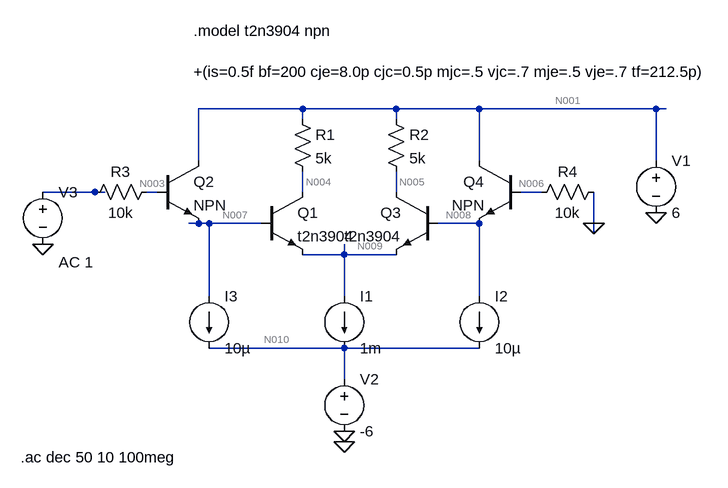
[diagram p0: schematic prob-3.asc]
prob-3.asc, the LTspice schematic file:
Version 4
SHEET 1 932 680
WIRE 176 0 16 0
WIRE 320 0 176 0
WIRE 448 0 320 0
WIRE 720 0 448 0
WIRE 736 0 720 0
WIRE 176 16 176 0
WIRE 320 16 320 0
WIRE 16 80 16 0
WIRE 448 80 448 0
WIRE 720 80 720 0
WIRE -144 128 -224 128
WIRE -128 128 -144 128
WIRE -48 128 -64 128
WIRE 176 128 176 96
WIRE 320 128 320 96
WIRE 544 128 512 128
WIRE 16 176 0 176
WIRE 32 176 16 176
WIRE 112 176 32 176
WIRE 448 176 384 176
WIRE 624 176 624 128
WIRE 624 192 624 176
WIRE 240 224 240 208
WIRE 240 224 176 224
WIRE 320 224 240 224
WIRE 32 288 32 176
WIRE 240 288 240 224
WIRE 448 288 448 176
WIRE 240 368 32 368
WIRE 448 368 240 368
WIRE 240 416 240 368
FLAG 240 512 0
FLAG 240 496 0
FLAG 720 160 0
FLAG 624 176 0
FLAG -224 208 0
SYMBOL npn 112 128 R0
SYMATTR InstName Q1
SYMATTR Value t2n3904
SYMBOL npn -48 80 R0
SYMATTR InstName Q2
SYMBOL npn 384 128 M0
SYMATTR InstName Q3
SYMATTR Value t2n3904
SYMBOL npn 512 80 M0
SYMATTR InstName Q4
SYMBOL current 240 288 R0
WINDOW 123 0 0 Left 2
WINDOW 39 0 0 Left 2
SYMATTR InstName I1
SYMATTR Value 1m
SYMBOL current 448 288 R0
WINDOW 123 0 0 Left 2
WINDOW 39 0 0 Left 2
SYMATTR InstName I2
SYMATTR Value 10µ
SYMBOL current 32 288 R0
WINDOW 123 0 0 Left 2
WINDOW 39 0 0 Left 2
SYMATTR InstName I3
SYMATTR Value 10µ
SYMBOL voltage 720 64 R0
WINDOW 123 0 0 Left 2
WINDOW 39 0 0 Left 2
SYMATTR InstName V1
SYMATTR Value 6
SYMBOL voltage 240 400 R0
WINDOW 123 0 0 Left 2
WINDOW 39 0 0 Left 2
SYMATTR InstName V2
SYMATTR Value -6
SYMBOL res 160 0 R0
SYMATTR InstName R1
SYMATTR Value 5k
SYMBOL res 304 0 R0
SYMATTR InstName R2
SYMATTR Value 5k
SYMBOL voltage -224 112 R0
WINDOW 123 24 124 Left 2
WINDOW 39 0 0 Left 2
SYMATTR InstName V3
SYMATTR Value ""
SYMATTR Value2 AC 1
SYMBOL res -48 112 R90
WINDOW 0 0 56 VBottom 2
WINDOW 3 32 56 VTop 2
SYMATTR InstName R3
SYMATTR Value 10k
SYMBOL res 640 112 R90
WINDOW 0 0 56 VBottom 2
WINDOW 3 32 56 VTop 2
SYMATTR InstName R4
SYMATTR Value 10k
TEXT 8 -120 Left 2 !.model t2n3904 npn\n\n+(is=0.5f bf=200 cje=8.0p cjc=0.5p mjc=.5 vjc=.7 mje=.5 vje=.7 tf=212.5p)
TEXT -258 536 Left 2 !.ac dec 50 10 100meg

The netlist it stands for:
* prob-3.asc
Q1 N004 N007 N009 0 t2n3904
Q2 N001 N003 N007 0 NPN
Q3 N005 N008 N009 0 t2n3904
Q4 N001 N006 N008 0 NPN
I1 N009 N010 1m
I2 N008 N010 10µ
I3 N007 N010 10µ
V1 N001 0 6
V2 N010 0 -6
R1 N001 N004 5k
R2 N001 N005 5k
V3 N002 0 AC 1
R3 N003 N002 10k
R4 0 N006 10k
.model NPN NPN
.model PNP PNP
.lib standard.bjt
.model t2n3904 npn
+(is=0.5f bf=200 cje=8.0p cjc=0.5p mjc=.5 vjc=.7 mje=.5 vje=.7 tf=212.5p)
.ac dec 50 10 100meg
.backanno
.end

* Results of the author's LTspice run, read from the files saved beside the schematic
* Operating Point, zero values left out:
*   V(n004) = 3.512 V
*   V(n007) = -661.8 mV
*   V(n009) = -1.376 V
*   V(n001) = 6 V
*   V(n003) = -1.236 mV
*   V(n005) = 3.512 V
*   V(n008) = -661.8 mV
*   V(n006) = -1.236 mV
*   V(n010) = -6 V
*   Ic(Q4) = 12.36 µA
*   Ib(Q4) = 123.6 nA
*   Ie(Q4) = -12.49 µA
*   Ic(Q2) = 12.36 µA
*   Ib(Q2) = 123.6 nA
*   Ie(Q2) = -12.49 µA
*   Ic(Q3) = 497.5 µA
*   Ib(Q3) = 2.488 µA
*   Ie(Q3) = -500 µA
*   Ic(Q1) = 497.5 µA
*   Ib(Q1) = 2.488 µA
*   Ie(Q1) = -500 µA
*   I(I3) = 10 µA
*   I(I2) = 10 µA
*   I(I1) = 1 mA
*   I(R4) = 123.6 nA
*   I(R3) = -123.6 nA
*   I(R2) = 497.5 µA
*   I(R1) = 497.5 µA
*   I(V3) = -123.6 nA
*   I(V2) = 1.02 mA
*   I(V1) = -1.02 mA
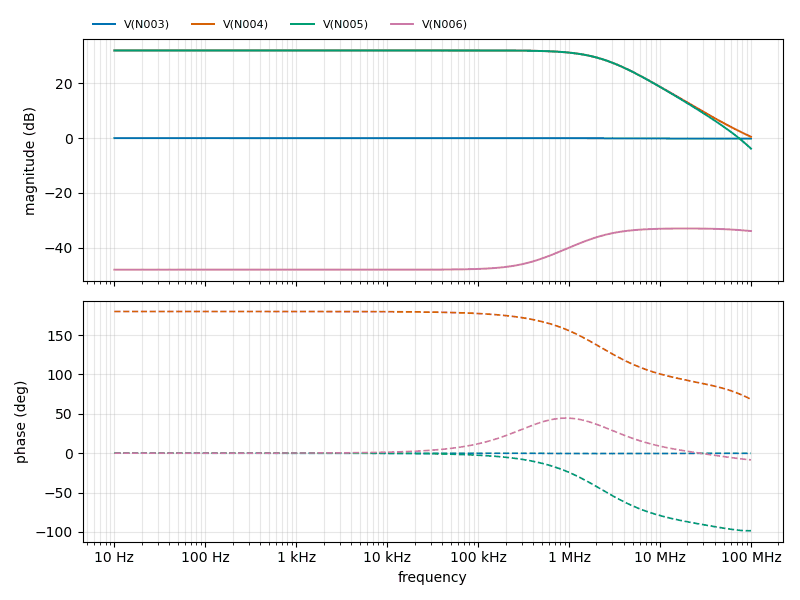
[diagram p1: AC Analysis of prob-3.asc, plotted from the saved traces]
* AC Analysis, 1 run:
*   V(N003): -0.03 dB at 10 Hz, -0.23 dB at 100 MHz, peak -0.03 dB at 10 Hz
*   V(N004): 31.99 dB at 10 Hz, 0.44 dB at 100 MHz, peak 31.99 dB at 10 Hz, 3 dB below the peak at 2.219 MHz
*   V(N005): 31.99 dB at 10 Hz, -3.87 dB at 100 MHz, peak 31.99 dB at 10 Hz, 3 dB below the peak at 2.217 MHz
*   V(N006): -48.09 dB at 10 Hz, -33.98 dB at 100 MHz, peak -33.04 dB at 19.05 MHz, 3 dB below the peak at 2.094 MHz